# Altium schematic sheet 飞镖电源TPS560430.SchDoc
size A3; SheetNumber: 1; SheetTotal: 1
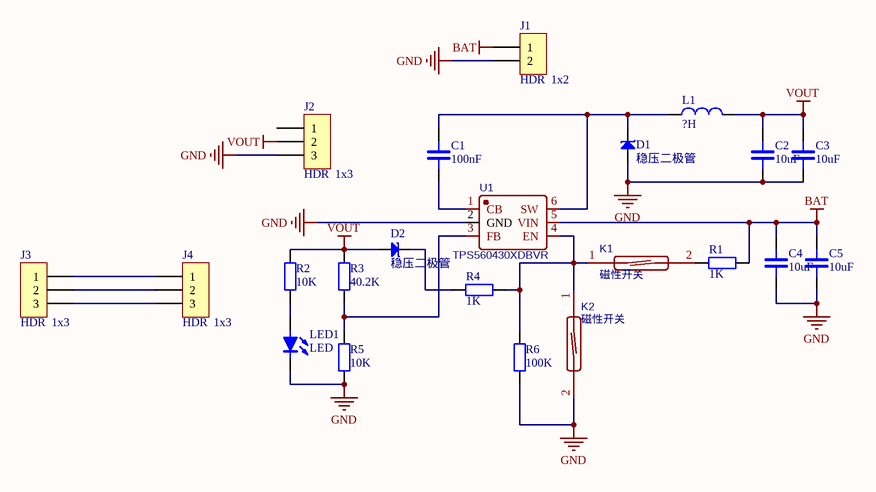
[diagram p0: 飞镖电源TPS560430.SchDoc]

## Parts
C1  100nF  [0603_C]
C2  10uF  [1206_C]
C3  10uF  [1206_C]
C4  10uF  [1206_C]
C5  10uF  [1206_C]
D1  稳压二极管  [SOD-123]
D2  稳压二极管  [SOD-123]
J1  HDR  1x2  [排针排母 2P 2.54mm]
J2  HDR  1x3  [排针排母 3P 2.54mm]
J3  HDR  1x3  [排针排母 3P 2.54mm]
J4  HDR  1x3  [排针排母 3P 2.54mm]
K1  磁性开关  [MKA14103]
K2  磁性开关  [MKA14103]
L1  ?H  [SMD_7*7*4MM]
LED1  LED  [LED_0603]
R1  1K  [0603_R]
R2  10K  [0603_R]
R3  40.2K  [0603_R]
R4  1K  [0603_R]
R5  10K  [0603_R]
R6  100K  [0603_R]
U1  TPS560430XDBVR  [SOT-23-6]

## Nets
BAT: C4.2 C5.2 J1.1 R1.2 U1.5(VIN)
GND: C2.1 C3.1 C4.1 C5.1 D1.1(A) J1.2 J2.3 K2.2 LED1.2(C) R5.1 R6.2 U1.2(GND)
VOUT: C2.2 C3.2 D2.1(A) J2.2 L1.2 R2.2 R3.2
NetC1_1: C1.1 D1.2(K) L1.1 U1.6(SW)
NetC1_2: C1.2 U1.1(CB)
NetD2_2: D2.2(K) R4.1
NetJ3_1: J3.1 J4.1
NetJ3_2: J3.2 J4.2
NetJ3_3: J3.3 J4.3
NetK1_1: K1.1 K2.1 R4.2 R6.1 U1.4(EN)
NetK1_2: K1.2 R1.1
NetLED1_1: LED1.1(A) R2.1
NetR3_1: R3.1 R5.2 U1.3(FB)

Not connected (* = marked no-connect by the designer): J2 1

## Library data of the parts
C1-C5 = CAP: Capacitor
J1 = HDR  1x2: Connector
J2-J4 = HDR  1x3: Connector
K1 K2 = 干簧管: 开关; BOM_Manufacturer: STANDEXMEDER; BOM_Manufacturer Part: KSK-SME560-1015; Contributor: LCSC; BOM_Supplier: LCSC; BOM_Supplier Part: C575284; BOM_JLCPCB Part Class: Extended Part; spicePre: K; spiceSymbolName: KSK-SME560-1015
L1 = Inductor: Code_IEC: 1005; Published: 8-Jun-2000; LatestRevisionDate: 17-Jul-2002; LatestRevisionNote: Re-released for DXP Platform.; PackageReference: 0402-A; Publisher: Altium Limited; Code_JEITA: 0402
R1-R6 = RES: Resistor
U1 = TPS560430XDBVR: BOM_Manufacturer: Texas Instruments; Contributor: LCSC; BOM_Supplier: LCSC; BOM_Supplier Part: C524782; BOM_Manufacturer Part: TPS560430XDBVR; BOM_JLCPCB Part Class: Extended Part; spicePre: U; spiceSymbolName: TPS560430XDBVR